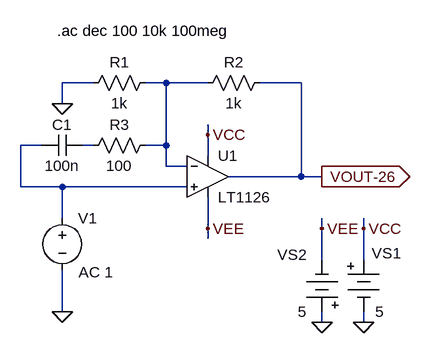
[diagram p0: schematic fig-03-01-39.asc]
fig-03-01-39.asc, the LTspice schematic file:
Version 4
SHEET 1 1172 772
WIRE 96 32 48 32
WIRE 208 32 176 32
WIRE 272 32 208 32
WIRE 416 32 352 32
WIRE 48 64 48 32
WIRE 272 112 272 96
WIRE 16 128 -16 128
WIRE 96 128 80 128
WIRE 208 128 208 32
WIRE 208 128 176 128
WIRE 272 144 272 112
WIRE 208 160 208 128
WIRE 240 160 208 160
WIRE 416 176 416 32
WIRE 416 176 304 176
WIRE 448 176 416 176
WIRE -16 192 -16 128
WIRE 48 192 -16 192
WIRE 240 192 48 192
WIRE 48 240 48 192
WIRE 272 256 272 208
WIRE 448 256 448 240
WIRE 512 256 512 240
WIRE 272 272 272 256
WIRE 448 304 448 256
WIRE 512 304 512 256
WIRE 48 384 48 320
WIRE 448 400 448 384
WIRE 512 400 512 384
FLAG 48 384 0
FLAG 448 176 VOUT-26
IOPIN 448 176 Out
FLAG 448 400 0
FLAG 512 400 0
FLAG 448 256 VEE
FLAG 512 256 VCC
FLAG 48 64 0
FLAG 272 112 VCC
FLAG 272 256 VEE
SYMBOL Misc\\battery 512 288 R0
WINDOW 0 13 6 Left 2
WINDOW 3 18 96 Left 2
WINDOW 123 0 0 Left 0
WINDOW 39 0 0 Left 0
SYMATTR InstName VS1
SYMATTR Value 5
SYMBOL Misc\\battery 448 400 R180
WINDOW 0 24 104 Left 2
WINDOW 3 24 16 Left 2
WINDOW 123 0 0 Left 0
WINDOW 39 0 0 Left 0
SYMATTR InstName VS2
SYMATTR Value 5
SYMBOL voltage 48 224 R0
WINDOW 3 -107 200 Left 2
WINDOW 123 25 99 Left 2
WINDOW 39 0 0 Left 0
SYMATTR Value ""
SYMATTR Value2 AC 1
SYMATTR InstName V1
SYMBOL res 368 16 R90
WINDOW 0 0 56 VBottom 2
WINDOW 3 32 56 VTop 2
SYMATTR InstName R2
SYMATTR Value 1k
SYMBOL res 192 16 R90
WINDOW 0 0 56 VBottom 2
WINDOW 3 32 56 VTop 2
SYMATTR InstName R1
SYMATTR Value 1k
SYMBOL Opamps\\LT1126 272 112 R0
SYMATTR InstName U1
SYMBOL res 192 112 R90
WINDOW 0 0 56 VBottom 2
WINDOW 3 32 56 VTop 2
SYMATTR InstName R3
SYMATTR Value 100
SYMBOL cap 80 112 R90
WINDOW 0 0 32 VBottom 2
WINDOW 3 32 32 VTop 2
SYMATTR InstName C1
SYMATTR Value 100n
TEXT 40 -48 Left 2 !.ac dec 100 10k 100meg

The netlist it stands for:
* fig-03-01-39.asc
VS1 VCC 0 5
VS2 0 VEE 5
V1 N002 0 AC 1
R2 VOUT-26 N001 1k
R1 N001 0 1k
XU1 N002 N001 VCC VEE VOUT-26 LT1126  ; pins In+ In- V+ V- OUT
R3 N001 N003 100
C1 N003 N002 100n
.ac dec 100 10k 100meg
.backanno
.end